# EAGLE design RaspberryPi-PICPgm-2 (EAGLE 7.2.0)
PIC Programmer using Raspberry Pi GPIOs http://holdenc.altervista.org/rpp/ http://holdenc.altervista.org/rpp/downloads/rpp010.tgz http://www.techmeology.co.uk/rpipic/rpipic-2012100701.tar.gz http://mujweb.cz/tlc/rpp/ https://github.com/oh7bf/PiPIC/tree/master/RaspiPICprog http://www.techmeology.co.uk/rpipic/
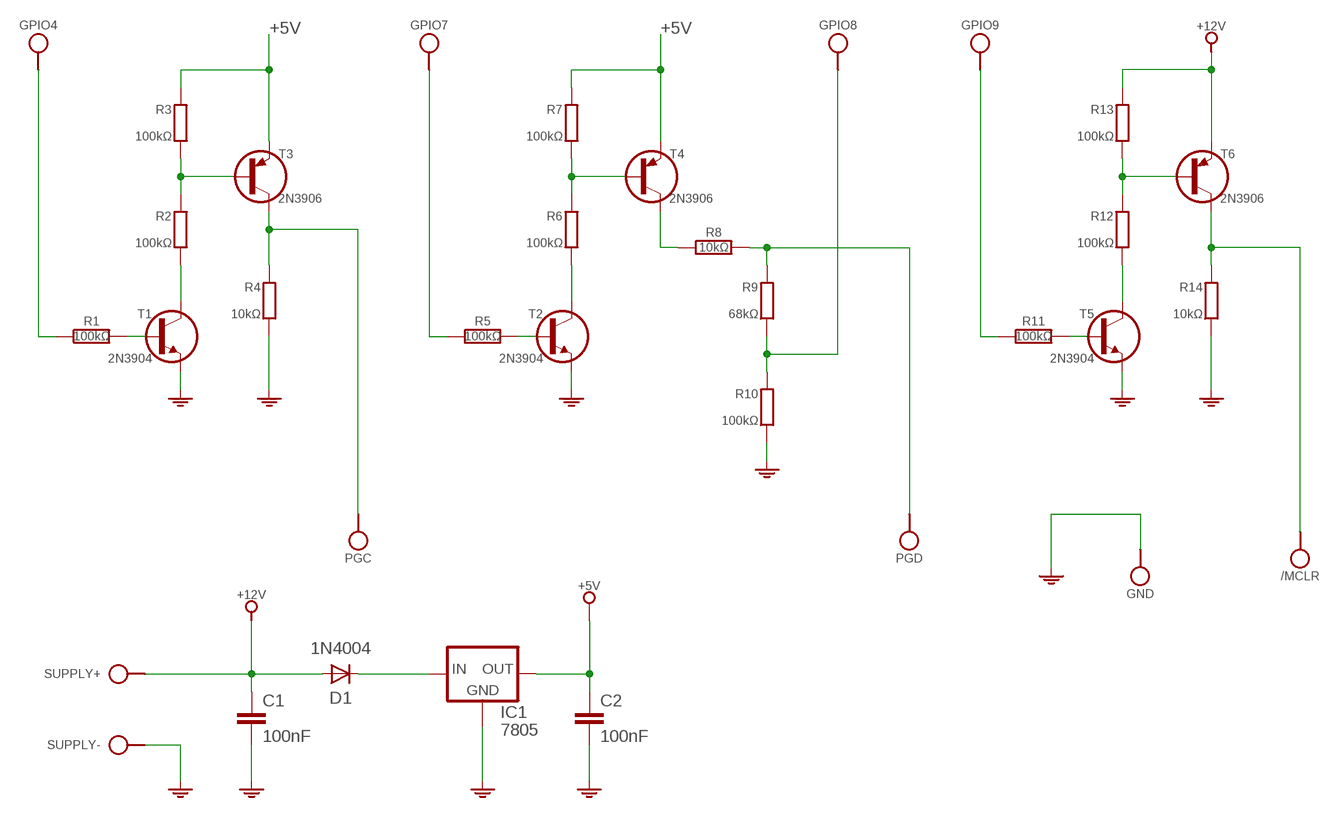
[diagram p0: schematic, sheet 1]

## Parts
/MCLR  VPORT  [SPAD]
C1  100nF  C050-025X075  [C050-025X075]
C2  100nF  C050-025X075  [C050-025X075]
D1  1N4004  1N4004-H  [DO41-10]
GND  VPORT  [SPAD]
GPIO4  VPORT  [SPAD]
GPIO7  VPORT  [SPAD]
GPIO8  VPORT  [SPAD]
GPIO9  VPORT  [SPAD]
IC1  7805  LM78  [TO220]
PGC  VPORT  [SPAD]
PGD  VPORT  [SPAD]
R1  100kΩ  R-H0204/10  [0204/10]
R2  100kΩ  R0204/10-V  [0204/10-V]
R3  100kΩ  R0204/10-V  [0204/10-V]
R4  10kΩ  R0204/10-V  [0204/10-V]
R5  100kΩ  R-H0204/10  [0204/10]
R6  100kΩ  R0204/10-V  [0204/10-V]
R7  100kΩ  R0204/10-V  [0204/10-V]
R8  10kΩ  R-H0204/10  [0204/10]
R9  68kΩ  R0204/10-V  [0204/10-V]
R10  100kΩ  R0204/10-V  [0204/10-V]
R11  100kΩ  R-H0204/10  [0204/10]
R12  100kΩ  R0204/10-V  [0204/10-V]
R13  100kΩ  R0204/10-V  [0204/10-V]
R14  10kΩ  R0204/10-V  [0204/10-V]
SUPPLY  SPAD+--+  [SPAD-+]
T1  2N3904  2N3904EBC  [TO92-EBC]
T2  2N3904  2N3904EBC  [TO92-EBC]
T3  2N3906  2N3906TO92-EBC  [TO92-EBC]
T4  2N3906  2N3906TO92-EBC  [TO92-EBC]
T5  2N3904  2N3904EBC  [TO92-EBC]
T6  2N3906  2N3906TO92-EBC  [TO92-EBC]

## Nets
+5V: C2.1 IC1.3(OUT) R3.1 R7.1 T3.E T4.E
+12V: C1.1 D1.A R13.1 SUPPLY.2 T6.E
GND: C1.2 C2.2 GND.1 IC1.2(GND) R4.2 R10.2 R14.2 SUPPLY.1 T1.E T2.E T5.E
N$1: GPIO4.1 R1.1
N$2: R1.2 T1.B
N$3: R2.2 T1.C
N$4: R2.1 R3.2 T3.B
N$5: PGC.1 R4.1 T3.C
N$6: GPIO7.1 R5.1
N$7: R5.2 T2.B
N$8: R6.2 T2.C
N$9: R6.1 R7.2 T4.B
N$10: R8.1 T4.C
N$11: PGD.1 R8.2 R9.1
N$12: GPIO8.1 R9.2 R10.1
N$13: GPIO9.1 R11.1
N$14: R11.2 T5.B
N$15: R12.2 T5.C
N$16: R12.1 R13.2 T6.B
N$17: /MCLR.1 R14.1 T6.C
N$18: D1.C IC1.1(IN)

## Library data of the parts
/MCLR GND GPIO4 GPIO7-GPIO9 PGC PGD = pad:VPORT
C1 C2 = c:C: CAPACITOR, European symbol
D1 = d:1N4004-H
IC1 = ic:LM78*
R1 R5 R8 R11 = r:R-H
R2-R4 R6 R7 R9 R10 R12-R14 = r:R: RESISTOR, European symbol
SUPPLY = pad:SPAD+-
T1 T2 T5 = t:2N3904
T3 T4 T6 = t:2N3906

## Board
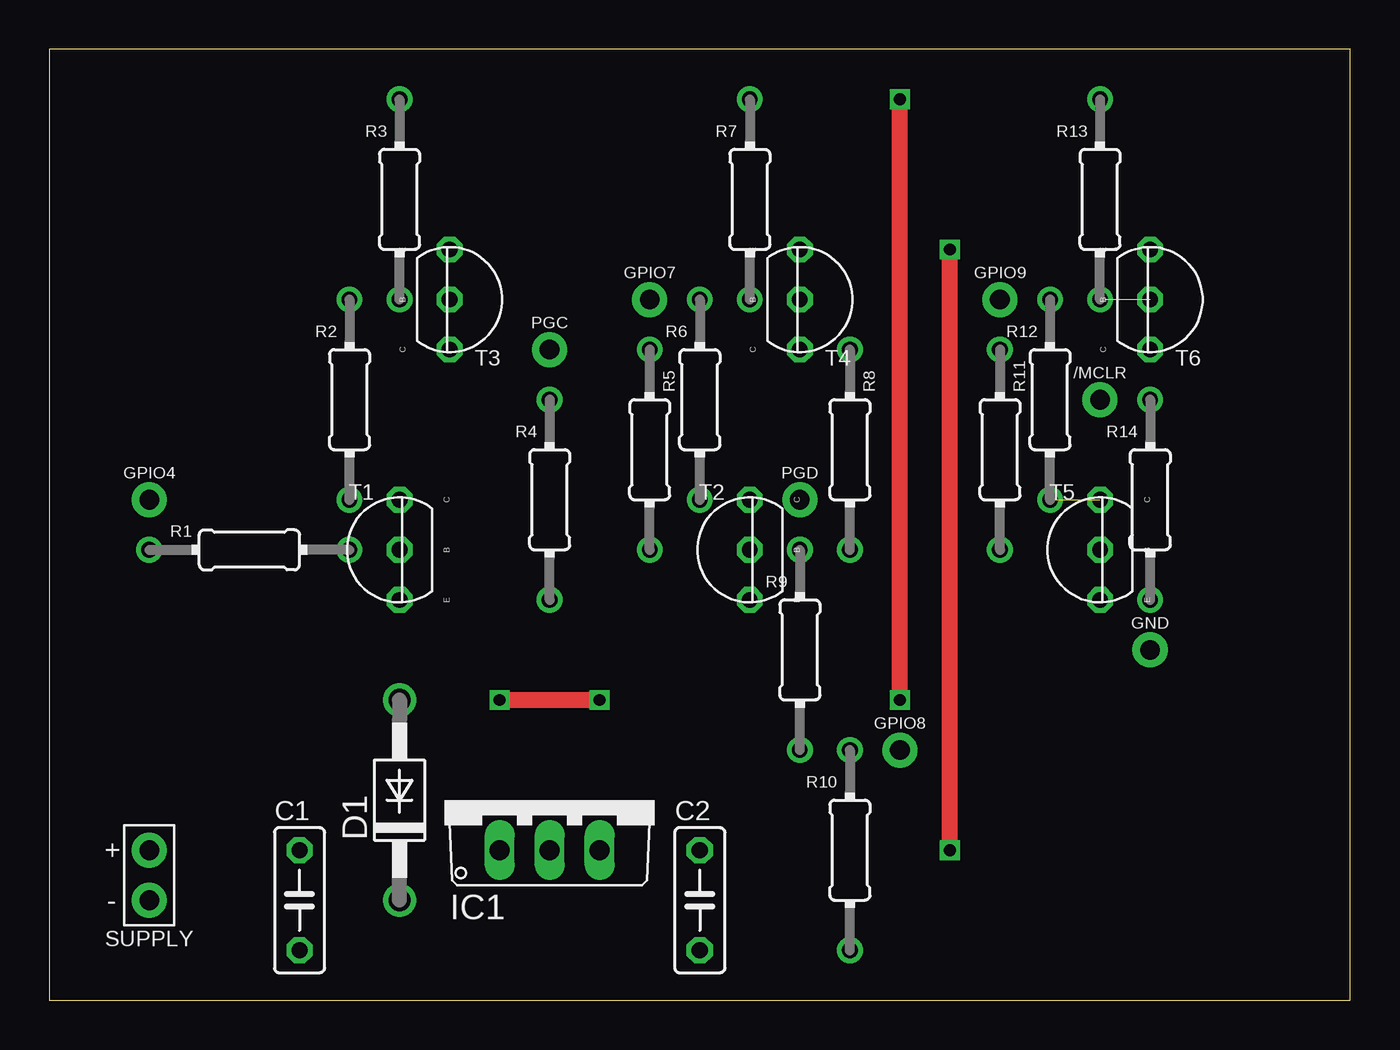
[diagram p1: board, top side]
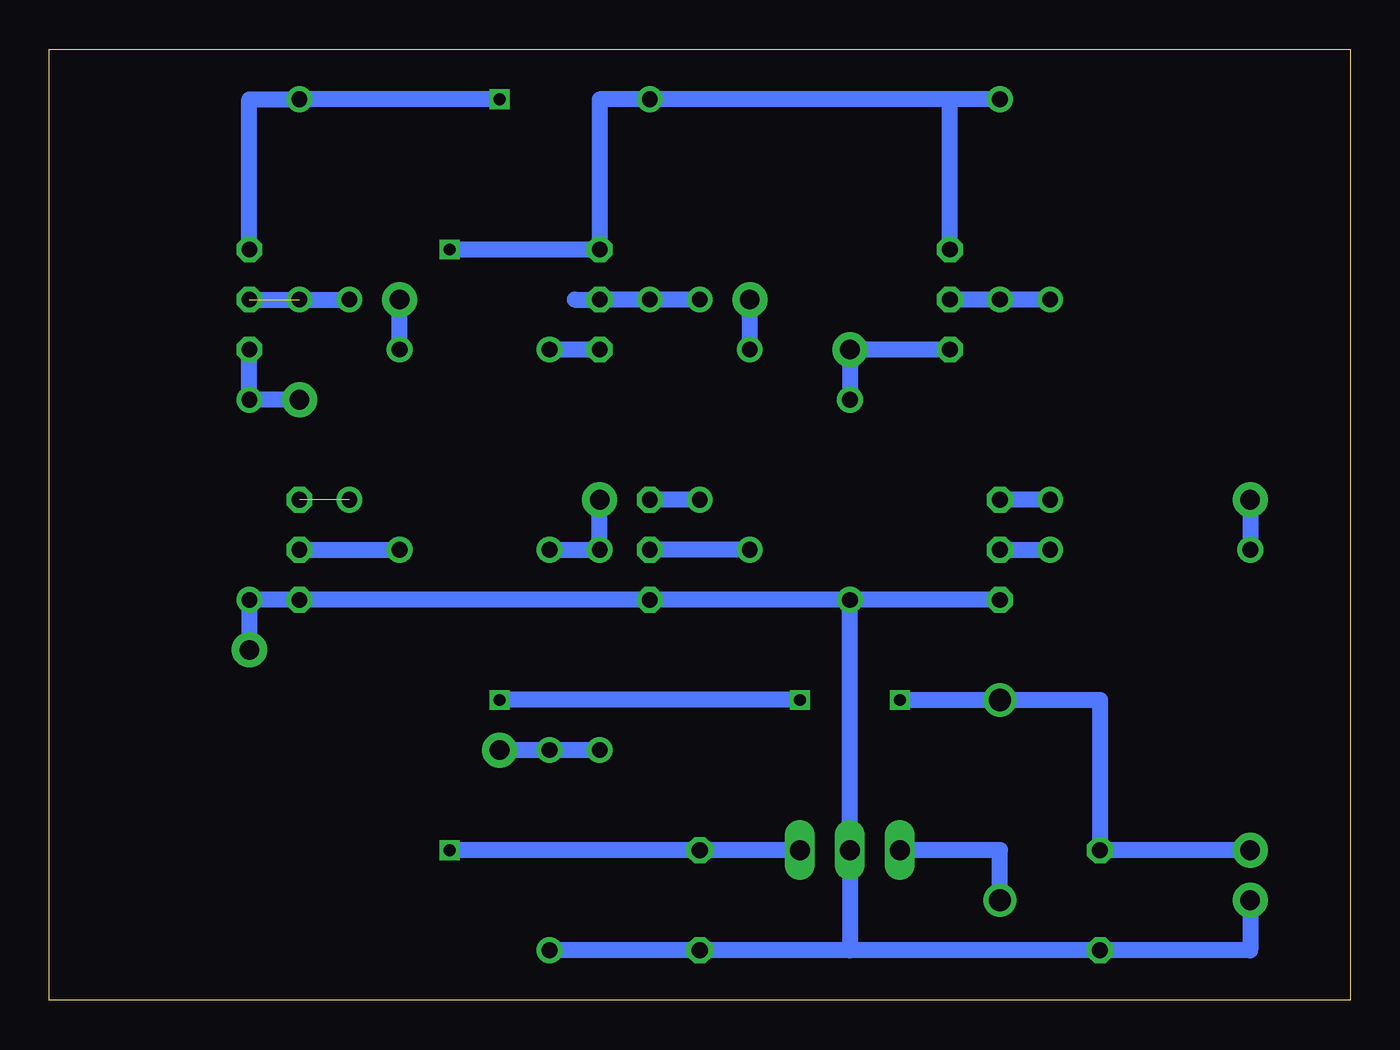
[diagram p2: board, bottom side, seen from below]

Size 66.04 x 48.26 mm. Coordinates in mm from the lower left corner, seen from the top.
Outline: 0,0 66.04,0 66.04,48.26 0,48.26 0,0
Copper layers (1*16): Top 0.035mm / dielectric 1.5mm / Bottom 0.035mm
Design rules "default": minimum track width 10mil, minimum drill 24mil, track to track 8mil, track to pad 8mil, pad to pad 8mil, via to via 8mil, smd to smd 8mil, copper to edge 40mil, drill to drill 8mil, minimum pad ring 10mil, minimum via ring 8mil, stop-mask expansion 4mil, vias tented up to drill 0mil, thermal gap 10mil

### Footprints (pad centres in the part's own frame; a part is rotated, then mirrored left to right if it is on the bottom)
SPAD = drill 1 pad 1.778: 1 0,0
C050-025X075 = drill 0.813 octagon: 1 2.54,0; 2 -2.54,0
DO41-10 = drill 1.118: A 5.08,0; C -5.08,0
TO220 = drill 1.016 long: 1 -2.54,-2.54; 2 0,-2.54; 3 2.54,-2.54
0204/10 = drill 0.8: 1 -5.08,0; 2 5.08,0
0204/10-V = drill 0.8: 1 0,5.08; 2 0,-5.08
SPAD-+ = drill 1 pad 1.778: 1 0,-1.27; 2 0,1.27
TO92-EBC = drill 0.8 octagon: B 0,0; C 0,2.54; E 0,-2.54

### Placement (x,y rotation side)
/MCLR  53.34,30.48 270 top
C1  12.7,5.08 90 top
C2  33.02,5.08 90 top
D1  17.78,10.16 90 top
GND  55.88,17.78 270 top
GPIO4  5.08,25.4 270 top
GPIO7  30.48,35.56 270 top
GPIO8  43.18,12.7 270 top
GPIO9  48.26,35.56 270 top
IC1  25.4,10.16 0 top
PGC  25.4,33.02 270 top
PGD  38.1,25.4 270 top
R1  10.16,22.86 0 top
R2  15.24,30.48 0 top
R3  17.78,40.64 0 top
R4  25.4,25.4 0 top
R5  30.48,27.94 270 top
R6  33.02,30.48 0 top
R7  35.56,40.64 0 top
R8  40.64,27.94 270 top
R9  38.1,17.78 0 top
R10  40.64,7.62 0 top
R11  48.26,27.94 270 top
R12  50.8,30.48 0 top
R13  53.34,40.64 0 top
R14  55.88,25.4 0 top
SUPPLY  5.08,6.35 0 top
T1  17.78,22.86 0 top
T2  35.56,22.86 0 top
T3  20.32,35.56 180 top
T4  38.1,35.56 180 top
T5  53.34,22.86 0 top
T6  55.88,35.56 180 top

### Tracks (layer width: path | path; a pad name or v marks a point on that pad's centre or on a via)
+5V  (via drill 0.6)
  Top 0.813: v45.72,7.62 v45.72,38.1
  Bottom 0.813: R3.1 20.32,45.72 | T3.E 20.32,45.72 | 20.32,45.72 R7.1 38.1,45.72 T4.E v45.72,38.1 | v45.72,7.62 C2.1 IC1.3
+12V  (via drill 0.6)
  Top 0.813: v22.86,15.24 v27.94,15.24 | v43.18,15.24 v43.18,45.72
  Bottom 0.813: T6.E 55.88,45.72 R13.1 v43.18,45.72 | SUPPLY.2 C1.1 12.7,15.24 D1.A v22.86,15.24 | v27.94,15.24 v43.18,15.24
GND
  Bottom 0.813: SUPPLY.1 5.08,2.54 C1.2 25.4,2.54 | 25.4,2.54 IC1.2 R4.2 | 25.4,2.54 C2.2 R10.2 | T1.E R4.2 | R4.2 T2.E T5.E R14.2 GND.1
N$1
  Bottom 0.813: GPIO4.1 R1.1
N$2
  Bottom 0.813: T1.B R1.2
N$3
  Bottom 0.813: R2.2 T1.C
N$4
  Bottom 0.813: R2.1 R3.2 T3.B
N$5
  Bottom 0.813: T3.C PGC.1 R4.1
N$6
  Bottom 0.813: R5.1 GPIO7.1
N$7
  Bottom 0.813: R5.2 T2.B
N$8
  Bottom 0.813: R6.2 T2.C
N$9
  Bottom 0.813: R6.1 R7.2 T4.B 39.37,35.56
N$10
  Bottom 0.813: T4.C R8.1
N$11
  Bottom 0.813: R8.2 R9.1 PGD.1
N$12
  Bottom 0.813: R9.2 R10.1 GPIO8.1
N$13
  Bottom 0.813: R11.1 GPIO9.1
N$14
  Bottom 0.813: T5.B R11.2
N$15  (1 unrouted)
N$16  (1 unrouted)
  Bottom 0.813: T6.B R12.1
N$17
  Bottom 0.813: /MCLR.1 R14.1 T6.C
N$18
  Bottom 0.813: D1.C 17.78,7.62 IC1.1